# Altium schematic sheet power_main_connector.SchDoc: nav_main_connector.schdoc
size A4; Engineer: Ryan Castle; Organization: Badgerloop; Address1: 133 Engineering Research; Address2: Building; Address3: Madison, WI 53715; DocumentNumber: 1; Revision: A; SheetNumber: 2; SheetTotal: 2
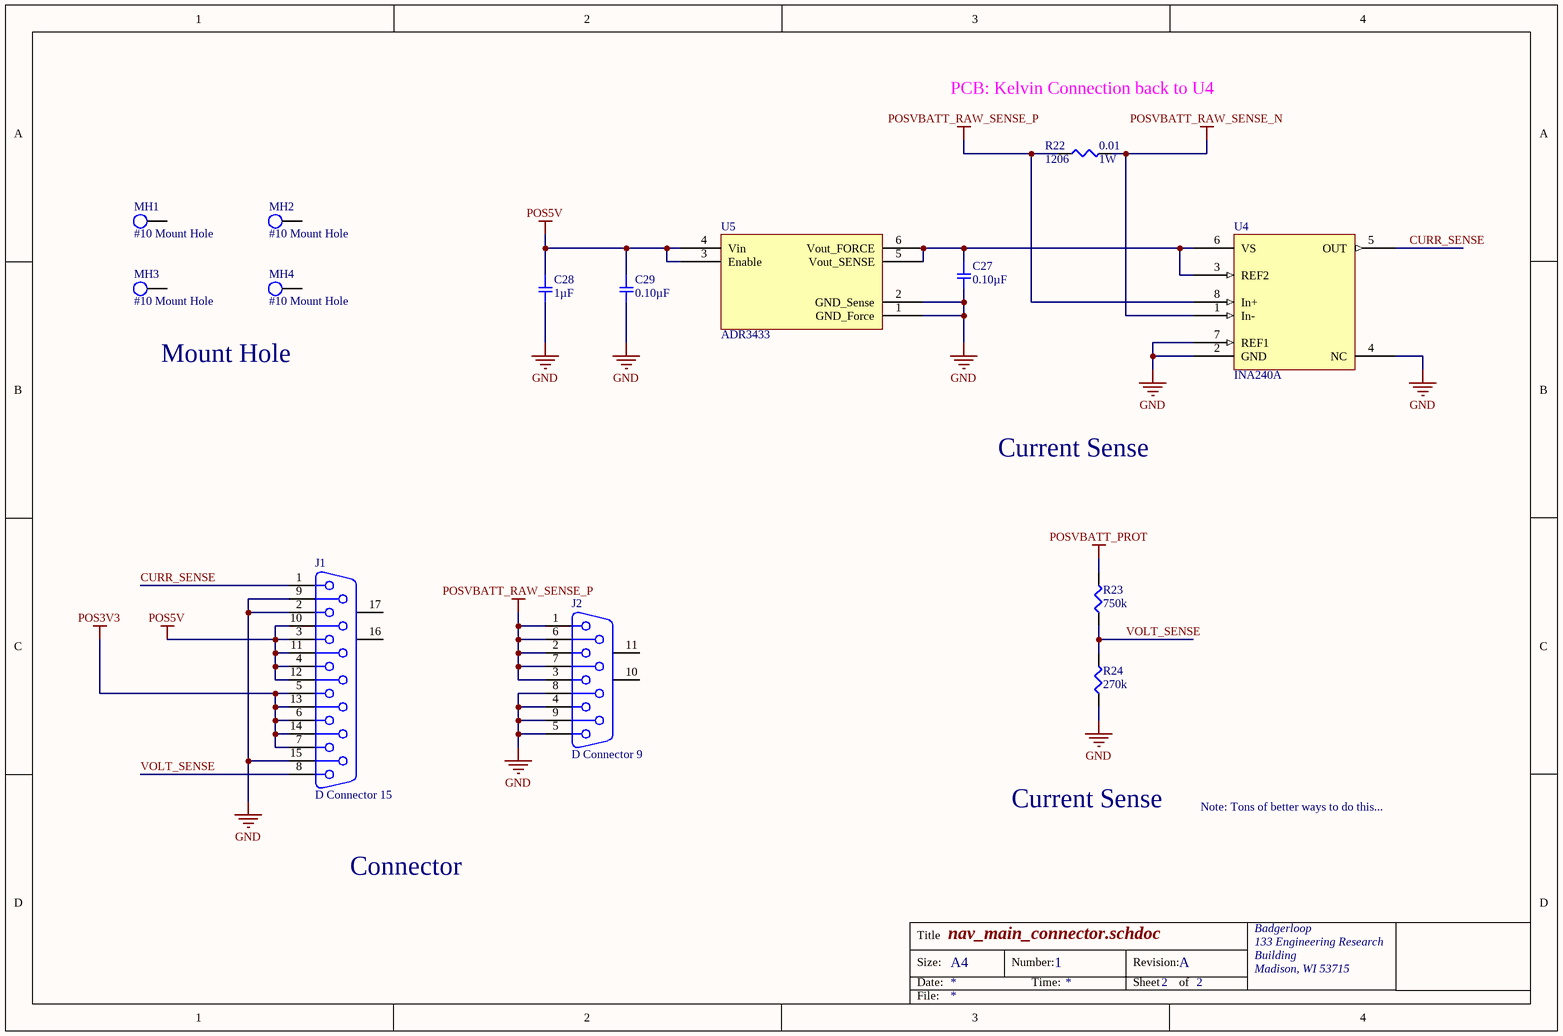
[diagram p0: power_main_connector.SchDoc]

## Parts
C27  0.10µF  [SMD-0805C]
C28  1µF  [SMD-0805C]
C29  0.10µF  [SMD-0805C]
J1  D Connector 15  [DSUB1.385-2H15]
J2  D Connector 9  [DSUB1.385-2H9]
MH1  #10 Mount Hole  [MH]
MH2  #10 Mount Hole  [MH]
MH3  #10 Mount Hole  [MH]
MH4  #10 Mount Hole  [MH]
R22  0.01  Power (Watts): 1W  Supplier Device Package: 1206  [SMD-1206-RES]
R23  750k  [SMD-0805-RES]
R24  270k  [SMD-0805-RES]
U4  INA240A  [SOIC127P600X175-8N]
U5  ADR3433  [SOT95P280X145-6N]

## Nets
GND: C27.2 C28.2 C29.2 J1.2 J1.9 J1.15 J2.4 J2.5 J2.8 J2.9 R24.1 U4.2(GND) U4.4(NC) U4.7(REF1) U5.1(GND_Force) U5.2(GND_Sense)
POS3V3: J1.5 J1.6 J1.7 J1.13 J1.14
POS5V: C28.1 C29.1 J1.3 J1.4 J1.10 J1.11 J1.12 U5.3(Enable) U5.4(Vin)
POSVBATT_PROT: R23.2
POSVBATT_RAW_SENSE_N: R22.2 U4.1(In-)
POSVBATT_RAW_SENSE_P: J2.1 J2.2 J2.3 J2.6 J2.7 R22.1 U4.8(In+)
CURR_SENSE: J1.1 U4.5(OUT)
VOLT_SENSE: J1.8 R23.1 R24.2
NetC27_1: C27.1 U4.3(REF2) U4.6(VS) U5.5(Vout_SENSE) U5.6(Vout_FORCE)

Not connected (* = marked no-connect by the designer): J1 16(MH1) 17(MH2); J2 10(MH1) 11(MH2); MH1 46; MH2 46; MH3 46; MH4 46

## Notes on the sheet
- PCB: Kelvin Connection back to U4
- Mount Hole
- Current Sense
- Note: Tons of better ways to do this...
- Connector
- Title
- Size:
- Date:
- A4
- Number:
- Time:
- Revision:
- Sheet
- of
- File:

## Library data of the parts
C27 C29 = GCD21BR71H104KA01L: CAP CER 0.1UF 50V X7R 0805; Manufacturer: Murata Electronics North America; Factory Stock: 0; Unit Price (USD): 0.24; Minimum Quantity: 1; Tolerance: ±10%; Datasheets: http://www.murata.com/~/media/webrenewal/support/library/catalog/products/capacitor/mlcc/c03e.ashx; Image: //media.digikey.com/Renders/Murata%20Renders/0805%28GxM6%29.jpg; Digi-Key Part Number: 490-11955-1-ND; Part Number: GCD21BR71H104KA01L; Quantity Available: 157; @ qty: 0; Packaging: Cut Tape (CT); Series: GCD; Part Status: Active; Value: 0.10µF; Voltage: 50V; Temperature Coefficient: X7R; Operating Temperature: -55°C ~ 125°C; Features: -; Ratings: AEC-Q200; Applications: Automotive; Mounting Type: Surface Mount, MLCC; Package / Case: 0805 (2012 Metric); Size / Dimension: 0.079" L x 0.049" W (2.00mm x 1.25mm); Height - Seated (Max): -; Thickness (Max): 0.049" (1.25mm); Lead Spacing: -; Lead Style: -
C28 = GCJ21BR71H105KA01L: CAP CER 1UF 50V X7R 0805; Manufacturer: Murata Electronics North America; Factory Stock: 0; Unit Price (USD): 0.33; Minimum Quantity: 1; Tolerance: ±10%; Datasheets: http://www.murata.com/~/media/webrenewal/support/library/catalog/products/capacitor/mlcc/c03e.ashx; Image: //media.digikey.com/Renders/Murata%20Renders/0805%20(2012%20Metric)%20.85mm.jpg; Digi-Key Part Number: 490-10667-1-ND; Part Number: GCJ21BR71H105KA01L; Quantity Available: 55137; @ qty: 0; Packaging: Cut Tape (CT); Series: GCJ; Part Status: Active; Value: 1µF; Voltage: 50V; Temperature Coefficient: X7R; Operating Temperature: -55°C ~ 125°C; Features: Soft Termination; Ratings: AEC-Q200; Applications: Automotive, Boardflex Sensitive; Mounting Type: Surface Mount, MLCC; Package / Case: 0805 (2012 Metric); Size / Dimension: 0.079" L x 0.049" W (2.00mm x 1.25mm); Height - Seated (Max): -; Thickness (Max): 0.057" (1.45mm); Lead Spacing: -; Lead Style: -
J1 = D Connector 15: Receptacle Assembly, 15 Position, Right Angle; PackageDocument: O; Positions: 15; Published: 15-Jun-2001; LatestRevisionDate: 17-Jul-2002; LatestRevisionNote: Re-released for DXP Platform.; DatasheetDocument: 1-Sep-99; PackageReference: 788757; Publisher: Altium Limited; Orientation: Right Angle; Gender: Receptacle
J2 = D Connector 9: Receptacle Assembly, 9 Position, Right Angle; PackageDocument: O; Positions: 9; Published: 15-Jun-2001; LatestRevisionDate: 17-Jul-2002; LatestRevisionNote: Re-released for DXP Platform.; DatasheetDocument: 1-Sep-1999; PackageReference: 788750; Publisher: Altium Limited; Orientation: Right Angle; Gender: Receptacle
R22 = ERJ-8CWFR010V: RES SMD 0.01 OHM 1% 1W 1206; Manufacturer: Panasonic Electronic Components; Factory Stock: 0; Unit Price (USD): 0.12302; @ qty: 1500; Minimum Quantity: 1; Temperature Coefficient: ±75ppm/°C; Part Number: ERJ-8CWFR010V; Datasheets: https://industrial.panasonic.com/cdbs/www-data/pdf/RDA0000/AOA0000C239.pdf; Image: //media.digikey.com/Renders/Panasonic%20Renders/ERJ-1206%20Pkg.jpg; Digi-Key Part Number: P0.01BVCT-ND; Quantity Available: 2; Packaging: Cut Tape (CT); Series: ERJ; Part Status: Active; Value: 0.01; Tolerance: ±1%; Composition: Thick Film; Features: Automotive AEC-Q200, Current Sense; Operating Temperature: -55°C ~ 155°C; Package / Case: 1206 (3216 Metric); Size / Dimension: 0.126" L x 0.063" W (3.20mm x 1.60mm); Height - Seated (Max): 0.030" (0.75mm); Number of Terminations: 2; Failure Rate: -
R23 = ERJ-6GEYJ754V: RES SMD 750K OHM 5% 1/8W 0805; Manufacturer: Panasonic Electronic Components; Factory Stock: 0; Unit Price (USD): 0.00496; @ qty: 1500; Minimum Quantity: 1; Power (Watts): 0.125W, 1/8W; Temperature Coefficient: ±200ppm/°C; Part Number: ERJ-6GEYJ754V; Datasheets: http://industrial.panasonic.com/www-cgi/jvcr13pz.cgi?E+PZ+3+AOA0001+ERJ6GEYJ754V+7+WW; Image: //media.digikey.com/Renders/Panasonic%20Renders/ERJ-0805%20Pkg.jpg; Digi-Key Part Number: P750KACT-ND; Quantity Available: 45411; Packaging: Cut Tape (CT); Series: ERJ; Part Status: Active; Value: 750k; Tolerance: ±5%; Composition: Thick Film; Features: Automotive AEC-Q200; Operating Temperature: -55°C ~ 155°C; Package / Case: 0805 (2012 Metric); Supplier Device Package: 0805; Size / Dimension: 0.079" L x 0.049" W (2.00mm x 1.25mm); Height - Seated (Max): 0.028" (0.70mm); Number of Terminations: 2; Failure Rate: -
R24 = ERJ-6GEYJ274V: RES SMD 270K OHM 5% 1/8W 0805; Manufacturer: Panasonic Electronic Components; Factory Stock: 0; Unit Price (USD): 0.00496; @ qty: 1500; Minimum Quantity: 1; Power (Watts): 0.125W, 1/8W; Temperature Coefficient: ±200ppm/°C; Part Number: ERJ-6GEYJ274V; Datasheets: http://industrial.panasonic.com/www-cgi/jvcr13pz.cgi?E+PZ+3+AOA0001+ERJ6GEYJ274V+7+WW; Image: //media.digikey.com/Renders/Panasonic%20Renders/ERJ-0805%20Pkg.jpg; Digi-Key Part Number: P270KACT-ND; Quantity Available: 55427; Packaging: Cut Tape (CT); Series: ERJ; Part Status: Active; Value: 270k; Tolerance: ±5%; Composition: Thick Film; Features: Automotive AEC-Q200; Operating Temperature: -55°C ~ 155°C; Package / Case: 0805 (2012 Metric); Supplier Device Package: 0805; Size / Dimension: 0.079" L x 0.049" W (2.00mm x 1.25mm); Height - Seated (Max): 0.028" (0.70mm); Number of Terminations: 2; Failure Rate: -
U4 = INA240A: IC AMP CURRENT SENSE 8-TSSOP; Manufacturer: TI; Manufacturer P/N: INA240A1PWR; Digikey P/N: 296-45088-1-ND; Digikey Link: https://www.digikey.com/product-detail/en/texas-instruments/INA240A1PWR/296-45088-1-ND/6562101
U5 = ADR3433: IC VREF SERIES 3.3V SOT23-6; Manufacturer: Analog Devices; Manufacturer P/N: ADR3433ARJZ-R7; ComponentLink1Description: Digikey; ComponentLink1URL: https://www.digikey.com/product-detail/en/analog-devices-inc/ADR3433ARJZ-R7/ADR3433ARJZ-R7CT-ND/4909083; Digikey Link: https://www.digikey.com/product-detail/en/analog-devices-inc/ADR3433ARJZ-R7/ADR3433ARJZ-R7CT-ND/4909083; Digikey P/N: ADR3433ARJZ-R7CT-ND